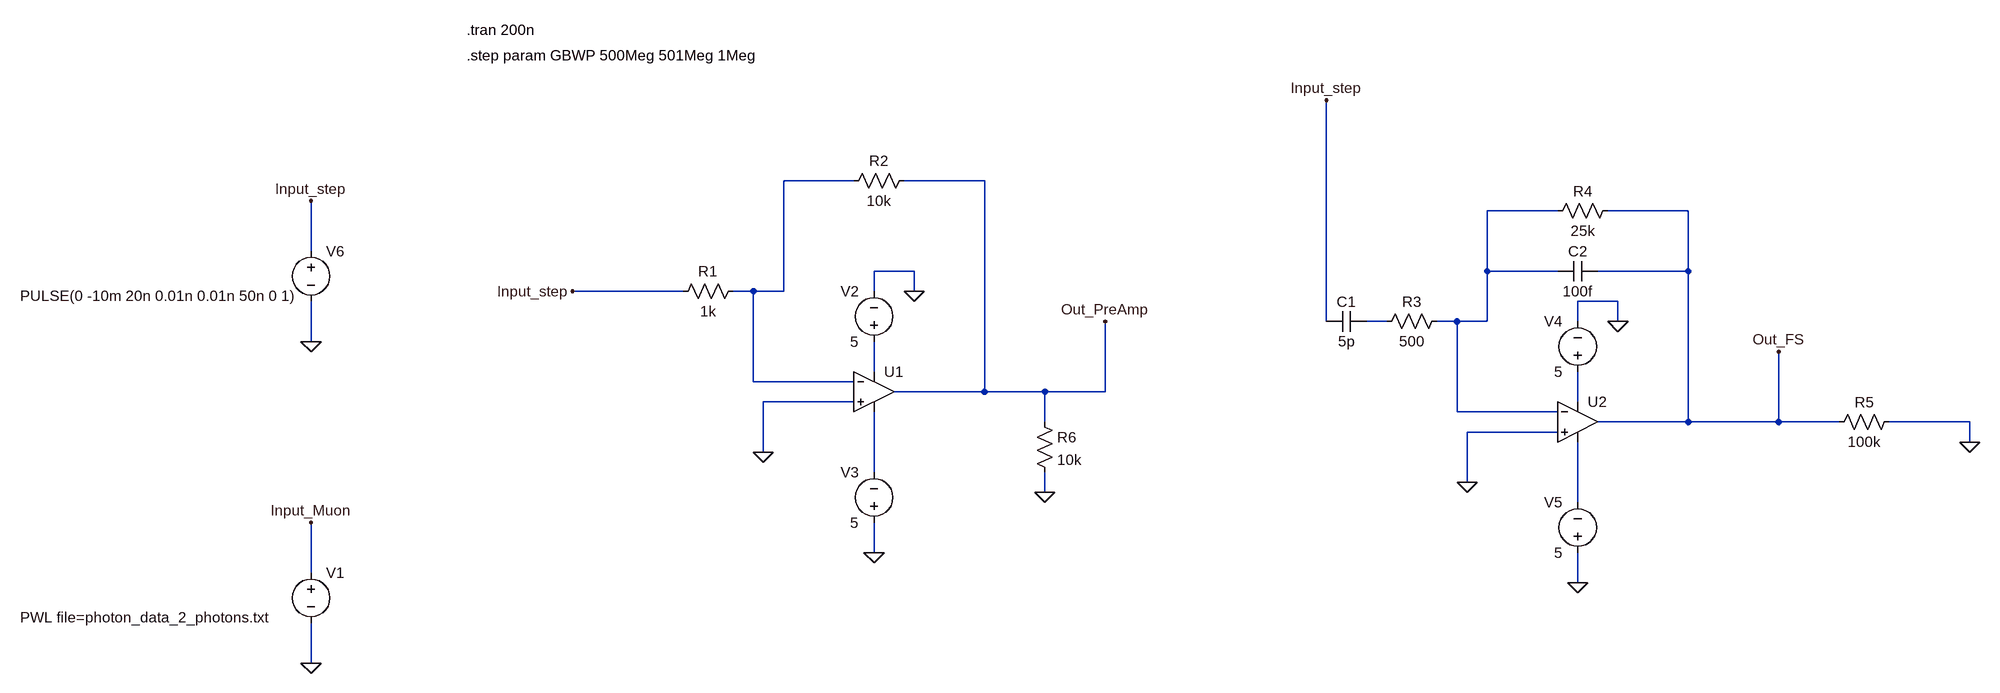
[diagram p0: schematic full_electronic_v3.asc]
full_electronic_v3.asc, the LTspice schematic file:
Version 4
SHEET 1 1956 680
WIRE 160 -240 48 -240
WIRE 368 -240 240 -240
WIRE 1280 -192 1168 -192
WIRE 1488 -192 1360 -192
WIRE -704 -128 -704 -208
WIRE 256 -96 192 -96
WIRE 1168 -96 1168 -192
WIRE 1280 -96 1168 -96
WIRE 1488 -96 1488 -192
WIRE 1488 -96 1344 -96
WIRE -112 -64 -288 -64
WIRE 0 -64 -32 -64
WIRE 48 -64 48 -240
WIRE 48 -64 0 -64
WIRE 192 -64 192 -96
WIRE 256 -64 256 -96
WIRE 1376 -48 1312 -48
WIRE 912 -16 912 -368
WIRE 1008 -16 976 -16
WIRE 1120 -16 1088 -16
WIRE 1168 -16 1168 -96
WIRE 1168 -16 1120 -16
WIRE 1312 -16 1312 -48
WIRE 1376 -16 1376 -48
WIRE -704 16 -704 -48
WIRE 192 64 192 16
WIRE 0 80 0 -64
WIRE 160 80 0 80
WIRE 368 96 368 -240
WIRE 368 96 224 96
WIRE 464 96 368 96
WIRE 560 96 560 -16
WIRE 560 96 464 96
WIRE 160 112 16 112
WIRE 1312 112 1312 64
WIRE 1120 128 1120 -16
WIRE 1280 128 1120 128
WIRE 464 144 464 96
WIRE 1488 144 1488 -96
WIRE 1488 144 1344 144
WIRE 1632 144 1632 32
WIRE 1632 144 1488 144
WIRE 1728 144 1632 144
WIRE 1936 144 1808 144
WIRE 1280 160 1136 160
WIRE 1936 176 1936 144
WIRE 16 192 16 112
WIRE 192 224 192 128
WIRE 1136 240 1136 160
WIRE 464 256 464 224
WIRE 1312 272 1312 176
WIRE 192 352 192 304
WIRE -704 384 -704 304
WIRE 1312 400 1312 352
WIRE -704 528 -704 464
FLAG 192 352 0
FLAG 256 -64 0
FLAG -704 528 0
FLAG 16 192 0
FLAG 1312 400 0
FLAG 1376 -16 0
FLAG 1136 240 0
FLAG 560 -16 Out_PreAmp
FLAG 1632 32 Out_FS
FLAG 1936 176 0
FLAG 912 -368 Input_step
FLAG -704 304 Input_Muon
FLAG -704 16 0
FLAG -704 -208 Input_step
FLAG -288 -64 Input_step
FLAG 464 256 0
SYMBOL res -16 -80 R90
WINDOW 0 0 56 VBottom 2
WINDOW 3 32 56 VTop 2
SYMATTR InstName R1
SYMATTR Value 1k
SYMBOL res 256 -256 R90
WINDOW 0 0 56 VBottom 2
WINDOW 3 32 56 VTop 2
SYMATTR InstName R2
SYMATTR Value 10k
SYMBOL voltage 192 32 R180
WINDOW 0 24 96 Left 2
WINDOW 3 24 16 Left 2
WINDOW 123 0 0 Left 0
WINDOW 39 0 0 Left 0
SYMATTR InstName V2
SYMATTR Value 5
SYMBOL voltage 192 320 R180
WINDOW 0 24 96 Left 2
WINDOW 3 24 16 Left 2
WINDOW 123 0 0 Left 0
WINDOW 39 0 0 Left 0
SYMATTR InstName V3
SYMATTR Value 5
SYMBOL OpAmps\\UniversalOpAmp1 192 96 R0
SYMATTR InstName U1
SYMATTR Value2 Avol=1Meg GBW={GBWP} Vos=0
SYMBOL res 1104 -32 R90
WINDOW 0 0 56 VBottom 2
WINDOW 3 32 56 VTop 2
SYMATTR InstName R3
SYMATTR Value 500
SYMBOL res 1376 -208 R90
WINDOW 0 0 56 VBottom 2
WINDOW 3 32 56 VTop 2
SYMATTR InstName R4
SYMATTR Value 25k
SYMBOL voltage 1312 80 R180
WINDOW 0 24 96 Left 2
WINDOW 3 24 16 Left 2
WINDOW 123 0 0 Left 0
WINDOW 39 0 0 Left 0
SYMATTR InstName V4
SYMATTR Value 5
SYMBOL voltage 1312 368 R180
WINDOW 0 24 96 Left 2
WINDOW 3 24 16 Left 2
WINDOW 123 0 0 Left 0
WINDOW 39 0 0 Left 0
SYMATTR InstName V5
SYMATTR Value 5
SYMBOL OpAmps\\UniversalOpAmp1 1312 144 R0
SYMATTR InstName U2
SYMATTR Value2 Avol=1Meg GBW={GBWP} Vos=0
SYMBOL voltage -704 368 R0
WINDOW 3 -463 87 Left 2
WINDOW 123 0 0 Left 0
WINDOW 39 0 0 Left 0
SYMATTR InstName V1
SYMATTR Value PWL file=photon_data_2_photons.txt
SYMBOL res 1824 128 R90
WINDOW 0 0 56 VBottom 2
WINDOW 3 32 56 VTop 2
SYMATTR InstName R5
SYMATTR Value 100k
SYMBOL cap 976 -32 R90
WINDOW 0 0 32 VBottom 2
WINDOW 3 32 32 VTop 2
SYMATTR InstName C1
SYMATTR Value 5p
SYMBOL cap 1344 -112 R90
WINDOW 0 0 32 VBottom 2
WINDOW 3 32 32 VTop 2
SYMATTR InstName C2
SYMATTR Value 100f
SYMBOL voltage -704 -144 R0
WINDOW 3 -463 87 Left 2
WINDOW 123 0 0 Left 0
WINDOW 39 0 0 Left 0
SYMATTR InstName V6
SYMATTR Value PULSE(0 -10m 20n 0.01n 0.01n 50n 0 1)
SYMBOL res 448 128 R0
SYMATTR InstName R6
SYMATTR Value 10k
TEXT -456 -440 Left 2 !.step param GBWP 500Meg 501Meg 1Meg
TEXT -456 -480 Left 2 !.tran 200n

The netlist it stands for:
* full_electronic_v3.asc
R1 N001 Input_step 1k
R2 Out_PreAmp N001 10k
V2 N004 0 5
V3 0 N006 5
XU1 0 N001 N004 N006 Out_PreAmp level1 Avol=1Meg GBW={GBWP} Vos=0 En=0 Enk=0 In=0 Ink=0 Rin=500Meg  ; pins In+ In- V+ V- OUT
R3 N002 N003 500
R4 Out_FS N002 25k
V4 N005 0 5
V5 0 N007 5
XU2 0 N002 N005 N007 Out_FS level1 Avol=1Meg GBW={GBWP} Vos=0 En=0 Enk=0 In=0 Ink=0 Rin=500Meg  ; pins In+ In- V+ V- OUT
V1 Input_Muon 0 PWL file=photon_data_2_photons.txt
R5 0 Out_FS 100k
C1 N003 Input_step 5p
C2 Out_FS N002 100f
V6 Input_step 0 PULSE(0 -10m 20n 0.01n 0.01n 50n 0 1)
R6 Out_PreAmp 0 10k
.step param GBWP 500Meg 501Meg 1Meg
.tran 200n
.lib UniversalOpAmp1.lib
.backanno
.end